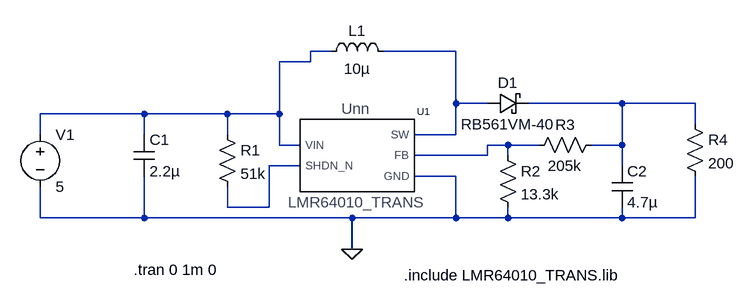
[diagram p0: schematic TI_LMR64010.asc]
TI_LMR64010.asc, the LTspice schematic file:
Version 4
SHEET 1 880 680
WIRE 128 0 96 0
WIRE 320 0 208 0
WIRE 96 16 96 0
WIRE 96 16 48 16
WIRE 320 80 320 0
WIRE 368 80 320 80
WIRE 576 80 432 80
WIRE 688 80 576 80
WIRE -160 96 -320 96
WIRE -32 96 -160 96
WIRE 48 96 48 16
WIRE 48 96 -32 96
WIRE 688 112 688 80
WIRE -320 128 -320 96
WIRE -160 128 -160 96
WIRE -32 128 -32 96
WIRE 320 128 320 80
WIRE 320 128 256 128
WIRE 48 144 48 96
WIRE 80 144 48 144
WIRE 400 144 368 144
WIRE 448 144 400 144
WIRE 576 144 576 80
WIRE 576 144 528 144
WIRE 368 160 368 144
WIRE 368 160 256 160
WIRE 400 160 400 144
WIRE 80 176 32 176
WIRE 576 176 576 144
WIRE 320 192 256 192
WIRE -32 240 -32 208
WIRE 32 240 32 176
WIRE 32 240 -32 240
WIRE -320 256 -320 208
WIRE -160 256 -160 192
WIRE -160 256 -320 256
WIRE 160 256 -160 256
WIRE 320 256 320 192
WIRE 320 256 160 256
WIRE 400 256 400 240
WIRE 400 256 320 256
WIRE 576 256 576 240
WIRE 576 256 400 256
WIRE 688 256 688 192
WIRE 688 256 576 256
WIRE 160 304 160 256
FLAG 160 304 0
SYMBOL LMR64010_TRANS 160 160 R0
SYMATTR InstName U1
SYMBOL res -48 112 R0
SYMATTR InstName R1
SYMATTR Value 51k
SYMBOL cap -176 128 R0
SYMATTR InstName C1
SYMATTR Value 2.2µ
SYMBOL ind 112 16 R270
WINDOW 0 32 56 VTop 2
WINDOW 3 5 56 VBottom 2
SYMATTR InstName L1
SYMATTR Value 10µ
SYMBOL schottky 368 96 R270
WINDOW 0 32 32 VTop 2
WINDOW 3 0 32 VBottom 2
SYMATTR InstName D1
SYMATTR Value RB561VM-40
SYMATTR Description Diode
SYMATTR Type diode
SYMBOL res 384 144 R0
SYMATTR InstName R2
SYMATTR Value 13.3k
SYMBOL res 544 128 R90
WINDOW 0 0 56 VBottom 2
WINDOW 3 32 56 VTop 2
SYMATTR InstName R3
SYMATTR Value 205k
SYMBOL cap 560 176 R0
SYMATTR InstName C2
SYMATTR Value 4.7µ
SYMBOL res 672 96 R0
SYMATTR InstName R4
SYMATTR Value 200
SYMBOL voltage -320 112 R0
WINDOW 123 0 0 Left 0
WINDOW 39 0 0 Left 0
SYMATTR InstName V1
SYMATTR Value 5
TEXT -176 336 Left 2 !.tran 0 1m 0
TEXT 240 344 Left 2 !.include LMR64010_TRANS.lib

The netlist it stands for:
* TI_LMR64010.asc
XU1 N001 N005 N002 N004 0 LMR64010_TRANS  ; pins VIN SHDN_N SW FB GND
R1 N001 N005 51k
C1 N001 0 2.2µ
L1 N001 N002 10µ
D1 N002 N003 RB561VM-40
R2 N004 0 13.3k
R3 N003 N004 205k
C2 N003 0 4.7µ
R4 N003 0 200
V1 N001 0 5
.model D D
.lib standard.dio
.tran 0 1m 0
.include LMR64010_TRANS.lib
.backanno
.end